# Altium schematic sheet Motor_Top_module.SchDoc
size A
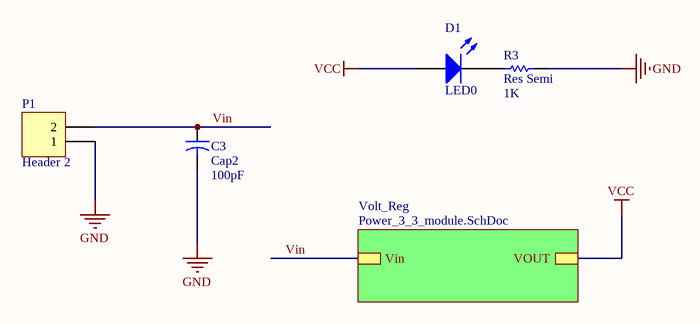
[diagram p0: Motor_Top_module.SchDoc]

## Parts
C3  Cap2  value 100pF  [CAPR5-4X5]
D1  LED0  [LED-0]
P1  Header 2  [HDR1X2]
R3  Res Semi  value 1K  [AXIAL-0.5]

## Sub-sheets
Volt_Reg = Power_3_3_module.SchDoc: Vin, VOUT

## Nets
GND: C3.2 P1.1 R3.2
VCC: D1.1(A) ; sheet Volt_Reg/VOUT
Vin: C3.1 P1.2 ; sheet Volt_Reg/Vin
NetD1_2: D1.2(K) R3.1

## Library data of the parts
C3 = Cap2: Capacitor; Published: 23-Sep-2002; PackageReference: CAPR5-4X5; Publisher: Altium Limited; PackageDescription: Capacitor; 2 Leads
D1 = LED0: Typical INFRARED GaAs LED; Published: 8-Jun-2000; LatestRevisionDate: 08-Jul-2005; LatestRevisionNote: Mech Layer 1 removed.; PackageReference: LED-0; Publisher: Altium Limited; PackageDescription: LED; 2 Leads
P1 = Header 2: Header, 2-Pin; LatestRevisionDate: 17-Jul-2002; LatestRevisionNote: Re-released for DXP Platform.; Publisher: Altium Limited
R3 = Res Semi: Semiconductor Resistor; Published: 8-Jun-2000; LatestRevisionDate: 17-Jul-2002; LatestRevisionNote: Re-released for DXP Platform.; PackageReference: AXIAL-0.5; Publisher: Altium Limited; PackageDescription: Axial Device, Thru-Hole; 2 Leads; 0.5 in Pin Spacing